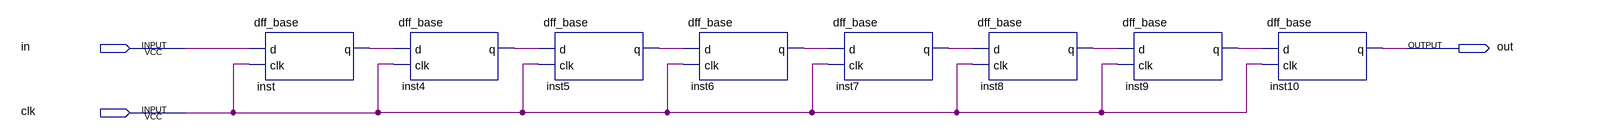
[diagram p0: schematic sheet]
// Quartus schematic ritardatore.bdf as structural Verilog: 8 symbols, 3 pins
module ritardatore (
  input  in,
  input  clk,
  output out
);

  wire inst4_q, inst5_q, inst6_q, inst7_q, inst8_q, inst9_q, inst_q;

  dff_base inst (.d(in), .clk(clk), .q(inst_q));
  dff_base inst4 (.d(inst_q), .clk(clk), .q(inst4_q));
  dff_base inst5 (.d(inst4_q), .clk(clk), .q(inst5_q));
  dff_base inst6 (.d(inst5_q), .clk(clk), .q(inst6_q));
  dff_base inst7 (.d(inst6_q), .clk(clk), .q(inst7_q));
  dff_base inst8 (.d(inst7_q), .clk(clk), .q(inst8_q));
  dff_base inst9 (.d(inst8_q), .clk(clk), .q(inst9_q));
  dff_base inst10 (.d(inst9_q), .clk(clk), .q(out));
endmodule
